# Altium project Mosquito.PrjPcb
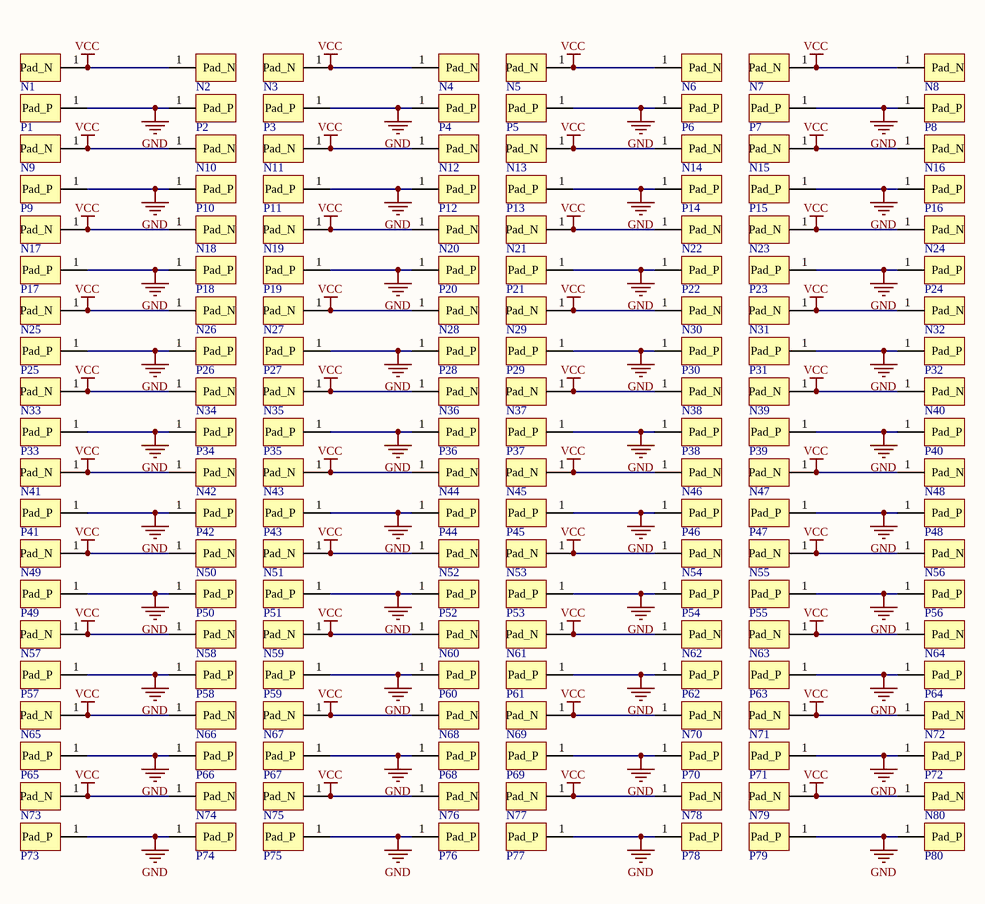
[diagram p0: Mosquito.SchDoc]
3 sheets, 400 parts. Net scope: global (net labels, ports and power ports of the same name join across sheets).
Board file: Mosquito.PcbDoc
Sheets:
  Mosquito.SchDoc
  Mosquito2.SchDoc
  Mosquito3.SchDoc

## Sheet Mosquito.SchDoc
size A4

### Parts
N1  Pad_N  [Pad]  (value not drawn)
N2  Pad_N  [Pad]  (value not drawn)
N3  Pad_N  [Pad]  (value not drawn)
N4  Pad_N  [Pad]  (value not drawn)
N5  Pad_N  [Pad]  (value not drawn)
N6  Pad_N  [Pad]  (value not drawn)
N7  Pad_N  [Pad]  (value not drawn)
N8  Pad_N  [Pad]  (value not drawn)
N9  Pad_N  [Pad]  (value not drawn)
N10  Pad_N  [Pad]  (value not drawn)
N11  Pad_N  [Pad]  (value not drawn)
N12  Pad_N  [Pad]  (value not drawn)
N13  Pad_N  [Pad]  (value not drawn)
N14  Pad_N  [Pad]  (value not drawn)
N15  Pad_N  [Pad]  (value not drawn)
N16  Pad_N  [Pad]  (value not drawn)
N17  Pad_N  [Pad]  (value not drawn)
N18  Pad_N  [Pad]  (value not drawn)
N19  Pad_N  [Pad]  (value not drawn)
N20  Pad_N  [Pad]  (value not drawn)
N21  Pad_N  [Pad]  (value not drawn)
N22  Pad_N  [Pad]  (value not drawn)
N23  Pad_N  [Pad]  (value not drawn)
N24  Pad_N  [Pad]  (value not drawn)
N25  Pad_N  [Pad]  (value not drawn)
N26  Pad_N  [Pad]  (value not drawn)
N27  Pad_N  [Pad]  (value not drawn)
N28  Pad_N  [Pad]  (value not drawn)
N29  Pad_N  [Pad]  (value not drawn)
N30  Pad_N  [Pad]  (value not drawn)
N31  Pad_N  [Pad]  (value not drawn)
N32  Pad_N  [Pad]  (value not drawn)
N33  Pad_N  [Pad]  (value not drawn)
N34  Pad_N  [Pad]  (value not drawn)
N35  Pad_N  [Pad]  (value not drawn)
N36  Pad_N  [Pad]  (value not drawn)
N37  Pad_N  [Pad]  (value not drawn)
N38  Pad_N  [Pad]  (value not drawn)
N39  Pad_N  [Pad]  (value not drawn)
N40  Pad_N  [Pad]  (value not drawn)
N41  Pad_N  [Pad]  (value not drawn)
N42  Pad_N  [Pad]  (value not drawn)
N43  Pad_N  [Pad]  (value not drawn)
N44  Pad_N  [Pad]  (value not drawn)
N45  Pad_N  [Pad]  (value not drawn)
N46  Pad_N  [Pad]  (value not drawn)
N47  Pad_N  [Pad]  (value not drawn)
N48  Pad_N  [Pad]  (value not drawn)
N49  Pad_N  [Pad]  (value not drawn)
N50  Pad_N  [Pad]  (value not drawn)
N51  Pad_N  [Pad]  (value not drawn)
N52  Pad_N  [Pad]  (value not drawn)
N53  Pad_N  [Pad]  (value not drawn)
N54  Pad_N  [Pad]  (value not drawn)
N55  Pad_N  [Pad]  (value not drawn)
N56  Pad_N  [Pad]  (value not drawn)
N57  Pad_N  [Pad]  (value not drawn)
N58  Pad_N  [Pad]  (value not drawn)
N59  Pad_N  [Pad]  (value not drawn)
N60  Pad_N  [Pad]  (value not drawn)
N61  Pad_N  [Pad]  (value not drawn)
N62  Pad_N  [Pad]  (value not drawn)
N63  Pad_N  [Pad]  (value not drawn)
N64  Pad_N  [Pad]  (value not drawn)
N65  Pad_N  [Pad]  (value not drawn)
N66  Pad_N  [Pad]  (value not drawn)
N67  Pad_N  [Pad]  (value not drawn)
N68  Pad_N  [Pad]  (value not drawn)
N69  Pad_N  [Pad]  (value not drawn)
N70  Pad_N  [Pad]  (value not drawn)
N71  Pad_N  [Pad]  (value not drawn)
N72  Pad_N  [Pad]  (value not drawn)
N73  Pad_N  [Pad]  (value not drawn)
N74  Pad_N  [Pad]  (value not drawn)
N75  Pad_N  [Pad]  (value not drawn)
N76  Pad_N  [Pad]  (value not drawn)
N77  Pad_N  [Pad]  (value not drawn)
N78  Pad_N  [Pad]  (value not drawn)
N79  Pad_N  [Pad]  (value not drawn)
N80  Pad_N  [Pad]  (value not drawn)
P1  Pad_P  [Pad]  (value not drawn)
P2  Pad_P  [Pad]  (value not drawn)
P3  Pad_P  [Pad]  (value not drawn)
P4  Pad_P  [Pad]  (value not drawn)
P5  Pad_P  [Pad]  (value not drawn)
P6  Pad_P  [Pad]  (value not drawn)
P7  Pad_P  [Pad]  (value not drawn)
P8  Pad_P  [Pad]  (value not drawn)
P9  Pad_P  [Pad]  (value not drawn)
P10  Pad_P  [Pad]  (value not drawn)
P11  Pad_P  [Pad]  (value not drawn)
P12  Pad_P  [Pad]  (value not drawn)
P13  Pad_P  [Pad]  (value not drawn)
P14  Pad_P  [Pad]  (value not drawn)
P15  Pad_P  [Pad]  (value not drawn)
P16  Pad_P  [Pad]  (value not drawn)
P17  Pad_P  [Pad]  (value not drawn)
P18  Pad_P  [Pad]  (value not drawn)
P19  Pad_P  [Pad]  (value not drawn)
P20  Pad_P  [Pad]  (value not drawn)
P21  Pad_P  [Pad]  (value not drawn)
P22  Pad_P  [Pad]  (value not drawn)
P23  Pad_P  [Pad]  (value not drawn)
P24  Pad_P  [Pad]  (value not drawn)
P25  Pad_P  [Pad]  (value not drawn)
P26  Pad_P  [Pad]  (value not drawn)
P27  Pad_P  [Pad]  (value not drawn)
P28  Pad_P  [Pad]  (value not drawn)
P29  Pad_P  [Pad]  (value not drawn)
P30  Pad_P  [Pad]  (value not drawn)
P31  Pad_P  [Pad]  (value not drawn)
P32  Pad_P  [Pad]  (value not drawn)
P33  Pad_P  [Pad]  (value not drawn)
P34  Pad_P  [Pad]  (value not drawn)
P35  Pad_P  [Pad]  (value not drawn)
P36  Pad_P  [Pad]  (value not drawn)
P37  Pad_P  [Pad]  (value not drawn)
P38  Pad_P  [Pad]  (value not drawn)
P39  Pad_P  [Pad]  (value not drawn)
P40  Pad_P  [Pad]  (value not drawn)
P41  Pad_P  [Pad]  (value not drawn)
P42  Pad_P  [Pad]  (value not drawn)
P43  Pad_P  [Pad]  (value not drawn)
P44  Pad_P  [Pad]  (value not drawn)
P45  Pad_P  [Pad]  (value not drawn)
P46  Pad_P  [Pad]  (value not drawn)
P47  Pad_P  [Pad]  (value not drawn)
P48  Pad_P  [Pad]  (value not drawn)
P49  Pad_P  [Pad]  (value not drawn)
P50  Pad_P  [Pad]  (value not drawn)
P51  Pad_P  [Pad]  (value not drawn)
P52  Pad_P  [Pad]  (value not drawn)
P53  Pad_P  [Pad]  (value not drawn)
P54  Pad_P  [Pad]  (value not drawn)
P55  Pad_P  [Pad]  (value not drawn)
P56  Pad_P  [Pad]  (value not drawn)
P57  Pad_P  [Pad]  (value not drawn)
P58  Pad_P  [Pad]  (value not drawn)
P59  Pad_P  [Pad]  (value not drawn)
P60  Pad_P  [Pad]  (value not drawn)
P61  Pad_P  [Pad]  (value not drawn)
P62  Pad_P  [Pad]  (value not drawn)
P63  Pad_P  [Pad]  (value not drawn)
P64  Pad_P  [Pad]  (value not drawn)
P65  Pad_P  [Pad]  (value not drawn)
P66  Pad_P  [Pad]  (value not drawn)
P67  Pad_P  [Pad]  (value not drawn)
P68  Pad_P  [Pad]  (value not drawn)
P69  Pad_P  [Pad]  (value not drawn)
P70  Pad_P  [Pad]  (value not drawn)
P71  Pad_P  [Pad]  (value not drawn)
P72  Pad_P  [Pad]  (value not drawn)
P73  Pad_P  [Pad]  (value not drawn)
P74  Pad_P  [Pad]  (value not drawn)
P75  Pad_P  [Pad]  (value not drawn)
P76  Pad_P  [Pad]  (value not drawn)
P77  Pad_P  [Pad]  (value not drawn)
P78  Pad_P  [Pad]  (value not drawn)
P79  Pad_P  [Pad]  (value not drawn)
P80  Pad_P  [Pad]  (value not drawn)

### Nets
GND: P1.1(Pad_P) P2.1(Pad_P) P3.1(Pad_P) P4.1(Pad_P) P5.1(Pad_P) P6.1(Pad_P) P7.1(Pad_P) P8.1(Pad_P) P9.1(Pad_P) P10.1(Pad_P) P11.1(Pad_P) P12.1(Pad_P) P13.1(Pad_P) P14.1(Pad_P) P15.1(Pad_P) P16.1(Pad_P) P17.1(Pad_P) P18.1(Pad_P) P19.1(Pad_P) P20.1(Pad_P) P21.1(Pad_P) P22.1(Pad_P) P23.1(Pad_P) P24.1(Pad_P) P25.1(Pad_P) P26.1(Pad_P) P27.1(Pad_P) P28.1(Pad_P) P29.1(Pad_P) P30.1(Pad_P) P31.1(Pad_P) P32.1(Pad_P) P33.1(Pad_P) P34.1(Pad_P) P35.1(Pad_P) P36.1(Pad_P) P37.1(Pad_P) P38.1(Pad_P) P39.1(Pad_P) P40.1(Pad_P) P41.1(Pad_P) P42.1(Pad_P) P43.1(Pad_P) P44.1(Pad_P) P45.1(Pad_P) P46.1(Pad_P) P47.1(Pad_P) P48.1(Pad_P) P49.1(Pad_P) P50.1(Pad_P) P51.1(Pad_P) P52.1(Pad_P) P53.1(Pad_P) P54.1(Pad_P) P55.1(Pad_P) P56.1(Pad_P) P57.1(Pad_P) P58.1(Pad_P) P59.1(Pad_P) P60.1(Pad_P) P61.1(Pad_P) P62.1(Pad_P) P63.1(Pad_P) P64.1(Pad_P) P65.1(Pad_P) P66.1(Pad_P) P67.1(Pad_P) P68.1(Pad_P) P69.1(Pad_P) P70.1(Pad_P) P71.1(Pad_P) P72.1(Pad_P) P73.1(Pad_P) P74.1(Pad_P) P75.1(Pad_P) P76.1(Pad_P) P77.1(Pad_P) P78.1(Pad_P) P79.1(Pad_P) P80.1(Pad_P)
VCC: N1.1(Pad_N) N2.1(Pad_N) N3.1(Pad_N) N4.1(Pad_N) N5.1(Pad_N) N6.1(Pad_N) N7.1(Pad_N) N8.1(Pad_N) N9.1(Pad_N) N10.1(Pad_N) N11.1(Pad_N) N12.1(Pad_N) N13.1(Pad_N) N14.1(Pad_N) N15.1(Pad_N) N16.1(Pad_N) N17.1(Pad_N) N18.1(Pad_N) N19.1(Pad_N) N20.1(Pad_N) N21.1(Pad_N) N22.1(Pad_N) N23.1(Pad_N) N24.1(Pad_N) N25.1(Pad_N) N26.1(Pad_N) N27.1(Pad_N) N28.1(Pad_N) N29.1(Pad_N) N30.1(Pad_N) N31.1(Pad_N) N32.1(Pad_N) N33.1(Pad_N) N34.1(Pad_N) N35.1(Pad_N) N36.1(Pad_N) N37.1(Pad_N) N38.1(Pad_N) N39.1(Pad_N) N40.1(Pad_N) N41.1(Pad_N) N42.1(Pad_N) N43.1(Pad_N) N44.1(Pad_N) N45.1(Pad_N) N46.1(Pad_N) N47.1(Pad_N) N48.1(Pad_N) N49.1(Pad_N) N50.1(Pad_N) N51.1(Pad_N) N52.1(Pad_N) N53.1(Pad_N) N54.1(Pad_N) N55.1(Pad_N) N56.1(Pad_N) N57.1(Pad_N) N58.1(Pad_N) N59.1(Pad_N) N60.1(Pad_N) N61.1(Pad_N) N62.1(Pad_N) N63.1(Pad_N) N64.1(Pad_N) N65.1(Pad_N) N66.1(Pad_N) N67.1(Pad_N) N68.1(Pad_N) N69.1(Pad_N) N70.1(Pad_N) N71.1(Pad_N) N72.1(Pad_N) N73.1(Pad_N) N74.1(Pad_N) N75.1(Pad_N) N76.1(Pad_N) N77.1(Pad_N) N78.1(Pad_N) N79.1(Pad_N) N80.1(Pad_N)

## Sheet Mosquito2.SchDoc
size A4
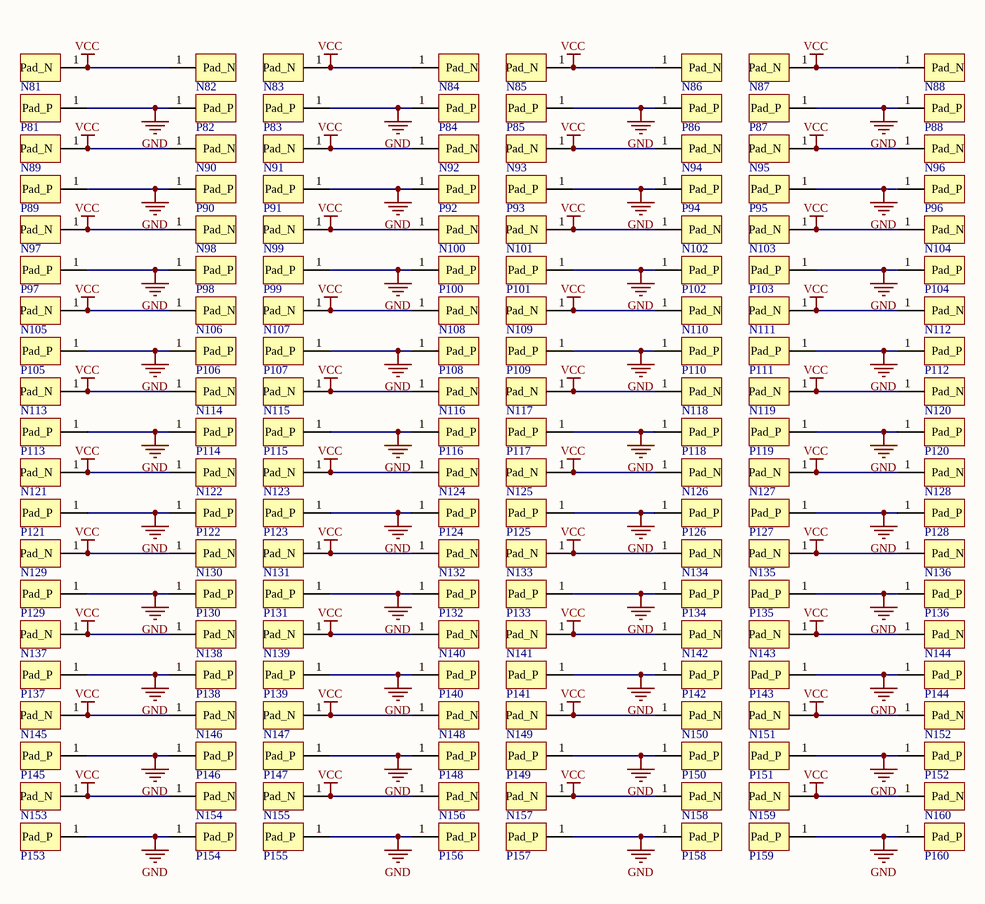
[diagram p1: Mosquito2.SchDoc]

### Parts
N81  Pad_N  [Pad]  (value not drawn)
N82  Pad_N  [Pad]  (value not drawn)
N83  Pad_N  [Pad]  (value not drawn)
N84  Pad_N  [Pad]  (value not drawn)
N85  Pad_N  [Pad]  (value not drawn)
N86  Pad_N  [Pad]  (value not drawn)
N87  Pad_N  [Pad]  (value not drawn)
N88  Pad_N  [Pad]  (value not drawn)
N89  Pad_N  [Pad]  (value not drawn)
N90  Pad_N  [Pad]  (value not drawn)
N91  Pad_N  [Pad]  (value not drawn)
N92  Pad_N  [Pad]  (value not drawn)
N93  Pad_N  [Pad]  (value not drawn)
N94  Pad_N  [Pad]  (value not drawn)
N95  Pad_N  [Pad]  (value not drawn)
N96  Pad_N  [Pad]  (value not drawn)
N97  Pad_N  [Pad]  (value not drawn)
N98  Pad_N  [Pad]  (value not drawn)
N99  Pad_N  [Pad]  (value not drawn)
N100  Pad_N  [Pad]  (value not drawn)
N101  Pad_N  [Pad]  (value not drawn)
N102  Pad_N  [Pad]  (value not drawn)
N103  Pad_N  [Pad]  (value not drawn)
N104  Pad_N  [Pad]  (value not drawn)
N105  Pad_N  [Pad]  (value not drawn)
N106  Pad_N  [Pad]  (value not drawn)
N107  Pad_N  [Pad]  (value not drawn)
N108  Pad_N  [Pad]  (value not drawn)
N109  Pad_N  [Pad]  (value not drawn)
N110  Pad_N  [Pad]  (value not drawn)
N111  Pad_N  [Pad]  (value not drawn)
N112  Pad_N  [Pad]  (value not drawn)
N113  Pad_N  [Pad]  (value not drawn)
N114  Pad_N  [Pad]  (value not drawn)
N115  Pad_N  [Pad]  (value not drawn)
N116  Pad_N  [Pad]  (value not drawn)
N117  Pad_N  [Pad]  (value not drawn)
N118  Pad_N  [Pad]  (value not drawn)
N119  Pad_N  [Pad]  (value not drawn)
N120  Pad_N  [Pad]  (value not drawn)
N121  Pad_N  [Pad]  (value not drawn)
N122  Pad_N  [Pad]  (value not drawn)
N123  Pad_N  [Pad]  (value not drawn)
N124  Pad_N  [Pad]  (value not drawn)
N125  Pad_N  [Pad]  (value not drawn)
N126  Pad_N  [Pad]  (value not drawn)
N127  Pad_N  [Pad]  (value not drawn)
N128  Pad_N  [Pad]  (value not drawn)
N129  Pad_N  [Pad]  (value not drawn)
N130  Pad_N  [Pad]  (value not drawn)
N131  Pad_N  [Pad]  (value not drawn)
N132  Pad_N  [Pad]  (value not drawn)
N133  Pad_N  [Pad]  (value not drawn)
N134  Pad_N  [Pad]  (value not drawn)
N135  Pad_N  [Pad]  (value not drawn)
N136  Pad_N  [Pad]  (value not drawn)
N137  Pad_N  [Pad]  (value not drawn)
N138  Pad_N  [Pad]  (value not drawn)
N139  Pad_N  [Pad]  (value not drawn)
N140  Pad_N  [Pad]  (value not drawn)
N141  Pad_N  [Pad]  (value not drawn)
N142  Pad_N  [Pad]  (value not drawn)
N143  Pad_N  [Pad]  (value not drawn)
N144  Pad_N  [Pad]  (value not drawn)
N145  Pad_N  [Pad]  (value not drawn)
N146  Pad_N  [Pad]  (value not drawn)
N147  Pad_N  [Pad]  (value not drawn)
N148  Pad_N  [Pad]  (value not drawn)
N149  Pad_N  [Pad]  (value not drawn)
N150  Pad_N  [Pad]  (value not drawn)
N151  Pad_N  [Pad]  (value not drawn)
N152  Pad_N  [Pad]  (value not drawn)
N153  Pad_N  [Pad]  (value not drawn)
N154  Pad_N  [Pad]  (value not drawn)
N155  Pad_N  [Pad]  (value not drawn)
N156  Pad_N  [Pad]  (value not drawn)
N157  Pad_N  [Pad]  (value not drawn)
N158  Pad_N  [Pad]  (value not drawn)
N159  Pad_N  [Pad]  (value not drawn)
N160  Pad_N  [Pad]  (value not drawn)
P81  Pad_P  [Pad]  (value not drawn)
P82  Pad_P  [Pad]  (value not drawn)
P83  Pad_P  [Pad]  (value not drawn)
P84  Pad_P  [Pad]  (value not drawn)
P85  Pad_P  [Pad]  (value not drawn)
P86  Pad_P  [Pad]  (value not drawn)
P87  Pad_P  [Pad]  (value not drawn)
P88  Pad_P  [Pad]  (value not drawn)
P89  Pad_P  [Pad]  (value not drawn)
P90  Pad_P  [Pad]  (value not drawn)
P91  Pad_P  [Pad]  (value not drawn)
P92  Pad_P  [Pad]  (value not drawn)
P93  Pad_P  [Pad]  (value not drawn)
P94  Pad_P  [Pad]  (value not drawn)
P95  Pad_P  [Pad]  (value not drawn)
P96  Pad_P  [Pad]  (value not drawn)
P97  Pad_P  [Pad]  (value not drawn)
P98  Pad_P  [Pad]  (value not drawn)
P99  Pad_P  [Pad]  (value not drawn)
P100  Pad_P  [Pad]  (value not drawn)
P101  Pad_P  [Pad]  (value not drawn)
P102  Pad_P  [Pad]  (value not drawn)
P103  Pad_P  [Pad]  (value not drawn)
P104  Pad_P  [Pad]  (value not drawn)
P105  Pad_P  [Pad]  (value not drawn)
P106  Pad_P  [Pad]  (value not drawn)
P107  Pad_P  [Pad]  (value not drawn)
P108  Pad_P  [Pad]  (value not drawn)
P109  Pad_P  [Pad]  (value not drawn)
P110  Pad_P  [Pad]  (value not drawn)
P111  Pad_P  [Pad]  (value not drawn)
P112  Pad_P  [Pad]  (value not drawn)
P113  Pad_P  [Pad]  (value not drawn)
P114  Pad_P  [Pad]  (value not drawn)
P115  Pad_P  [Pad]  (value not drawn)
P116  Pad_P  [Pad]  (value not drawn)
P117  Pad_P  [Pad]  (value not drawn)
P118  Pad_P  [Pad]  (value not drawn)
P119  Pad_P  [Pad]  (value not drawn)
P120  Pad_P  [Pad]  (value not drawn)
P121  Pad_P  [Pad]  (value not drawn)
P122  Pad_P  [Pad]  (value not drawn)
P123  Pad_P  [Pad]  (value not drawn)
P124  Pad_P  [Pad]  (value not drawn)
P125  Pad_P  [Pad]  (value not drawn)
P126  Pad_P  [Pad]  (value not drawn)
P127  Pad_P  [Pad]  (value not drawn)
P128  Pad_P  [Pad]  (value not drawn)
P129  Pad_P  [Pad]  (value not drawn)
P130  Pad_P  [Pad]  (value not drawn)
P131  Pad_P  [Pad]  (value not drawn)
P132  Pad_P  [Pad]  (value not drawn)
P133  Pad_P  [Pad]  (value not drawn)
P134  Pad_P  [Pad]  (value not drawn)
P135  Pad_P  [Pad]  (value not drawn)
P136  Pad_P  [Pad]  (value not drawn)
P137  Pad_P  [Pad]  (value not drawn)
P138  Pad_P  [Pad]  (value not drawn)
P139  Pad_P  [Pad]  (value not drawn)
P140  Pad_P  [Pad]  (value not drawn)
P141  Pad_P  [Pad]  (value not drawn)
P142  Pad_P  [Pad]  (value not drawn)
P143  Pad_P  [Pad]  (value not drawn)
P144  Pad_P  [Pad]  (value not drawn)
P145  Pad_P  [Pad]  (value not drawn)
P146  Pad_P  [Pad]  (value not drawn)
P147  Pad_P  [Pad]  (value not drawn)
P148  Pad_P  [Pad]  (value not drawn)
P149  Pad_P  [Pad]  (value not drawn)
P150  Pad_P  [Pad]  (value not drawn)
P151  Pad_P  [Pad]  (value not drawn)
P152  Pad_P  [Pad]  (value not drawn)
P153  Pad_P  [Pad]  (value not drawn)
P154  Pad_P  [Pad]  (value not drawn)
P155  Pad_P  [Pad]  (value not drawn)
P156  Pad_P  [Pad]  (value not drawn)
P157  Pad_P  [Pad]  (value not drawn)
P158  Pad_P  [Pad]  (value not drawn)
P159  Pad_P  [Pad]  (value not drawn)
P160  Pad_P  [Pad]  (value not drawn)

### Nets
GND: P81.1(Pad_P) P82.1(Pad_P) P83.1(Pad_P) P84.1(Pad_P) P85.1(Pad_P) P86.1(Pad_P) P87.1(Pad_P) P88.1(Pad_P) P89.1(Pad_P) P90.1(Pad_P) P91.1(Pad_P) P92.1(Pad_P) P93.1(Pad_P) P94.1(Pad_P) P95.1(Pad_P) P96.1(Pad_P) P97.1(Pad_P) P98.1(Pad_P) P99.1(Pad_P) P100.1(Pad_P) P101.1(Pad_P) P102.1(Pad_P) P103.1(Pad_P) P104.1(Pad_P) P105.1(Pad_P) P106.1(Pad_P) P107.1(Pad_P) P108.1(Pad_P) P109.1(Pad_P) P110.1(Pad_P) P111.1(Pad_P) P112.1(Pad_P) P113.1(Pad_P) P114.1(Pad_P) P115.1(Pad_P) P116.1(Pad_P) P117.1(Pad_P) P118.1(Pad_P) P119.1(Pad_P) P120.1(Pad_P) P121.1(Pad_P) P122.1(Pad_P) P123.1(Pad_P) P124.1(Pad_P) P125.1(Pad_P) P126.1(Pad_P) P127.1(Pad_P) P128.1(Pad_P) P129.1(Pad_P) P130.1(Pad_P) P131.1(Pad_P) P132.1(Pad_P) P133.1(Pad_P) P134.1(Pad_P) P135.1(Pad_P) P136.1(Pad_P) P137.1(Pad_P) P138.1(Pad_P) P139.1(Pad_P) P140.1(Pad_P) P141.1(Pad_P) P142.1(Pad_P) P143.1(Pad_P) P144.1(Pad_P) P145.1(Pad_P) P146.1(Pad_P) P147.1(Pad_P) P148.1(Pad_P) P149.1(Pad_P) P150.1(Pad_P) P151.1(Pad_P) P152.1(Pad_P) P153.1(Pad_P) P154.1(Pad_P) P155.1(Pad_P) P156.1(Pad_P) P157.1(Pad_P) P158.1(Pad_P) P159.1(Pad_P) P160.1(Pad_P)
VCC: N81.1(Pad_N) N82.1(Pad_N) N83.1(Pad_N) N84.1(Pad_N) N85.1(Pad_N) N86.1(Pad_N) N87.1(Pad_N) N88.1(Pad_N) N89.1(Pad_N) N90.1(Pad_N) N91.1(Pad_N) N92.1(Pad_N) N93.1(Pad_N) N94.1(Pad_N) N95.1(Pad_N) N96.1(Pad_N) N97.1(Pad_N) N98.1(Pad_N) N99.1(Pad_N) N100.1(Pad_N) N101.1(Pad_N) N102.1(Pad_N) N103.1(Pad_N) N104.1(Pad_N) N105.1(Pad_N) N106.1(Pad_N) N107.1(Pad_N) N108.1(Pad_N) N109.1(Pad_N) N110.1(Pad_N) N111.1(Pad_N) N112.1(Pad_N) N113.1(Pad_N) N114.1(Pad_N) N115.1(Pad_N) N116.1(Pad_N) N117.1(Pad_N) N118.1(Pad_N) N119.1(Pad_N) N120.1(Pad_N) N121.1(Pad_N) N122.1(Pad_N) N123.1(Pad_N) N124.1(Pad_N) N125.1(Pad_N) N126.1(Pad_N) N127.1(Pad_N) N128.1(Pad_N) N129.1(Pad_N) N130.1(Pad_N) N131.1(Pad_N) N132.1(Pad_N) N133.1(Pad_N) N134.1(Pad_N) N135.1(Pad_N) N136.1(Pad_N) N137.1(Pad_N) N138.1(Pad_N) N139.1(Pad_N) N140.1(Pad_N) N141.1(Pad_N) N142.1(Pad_N) N143.1(Pad_N) N144.1(Pad_N) N145.1(Pad_N) N146.1(Pad_N) N147.1(Pad_N) N148.1(Pad_N) N149.1(Pad_N) N150.1(Pad_N) N151.1(Pad_N) N152.1(Pad_N) N153.1(Pad_N) N154.1(Pad_N) N155.1(Pad_N) N156.1(Pad_N) N157.1(Pad_N) N158.1(Pad_N) N159.1(Pad_N) N160.1(Pad_N)

## Sheet Mosquito3.SchDoc
size A4
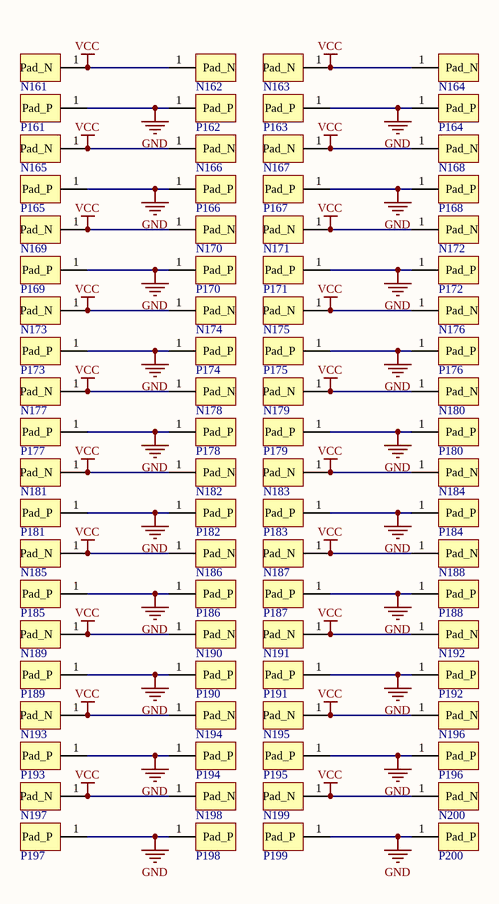
[diagram p2: Mosquito3.SchDoc]

### Parts
N161  Pad_N  [Pad]  (value not drawn)
N162  Pad_N  [Pad]  (value not drawn)
N163  Pad_N  [Pad]  (value not drawn)
N164  Pad_N  [Pad]  (value not drawn)
N165  Pad_N  [Pad]  (value not drawn)
N166  Pad_N  [Pad]  (value not drawn)
N167  Pad_N  [Pad]  (value not drawn)
N168  Pad_N  [Pad]  (value not drawn)
N169  Pad_N  [Pad]  (value not drawn)
N170  Pad_N  [Pad]  (value not drawn)
N171  Pad_N  [Pad]  (value not drawn)
N172  Pad_N  [Pad]  (value not drawn)
N173  Pad_N  [Pad]  (value not drawn)
N174  Pad_N  [Pad]  (value not drawn)
N175  Pad_N  [Pad]  (value not drawn)
N176  Pad_N  [Pad]  (value not drawn)
N177  Pad_N  [Pad]  (value not drawn)
N178  Pad_N  [Pad]  (value not drawn)
N179  Pad_N  [Pad]  (value not drawn)
N180  Pad_N  [Pad]  (value not drawn)
N181  Pad_N  [Pad]  (value not drawn)
N182  Pad_N  [Pad]  (value not drawn)
N183  Pad_N  [Pad]  (value not drawn)
N184  Pad_N  [Pad]  (value not drawn)
N185  Pad_N  [Pad]  (value not drawn)
N186  Pad_N  [Pad]  (value not drawn)
N187  Pad_N  [Pad]  (value not drawn)
N188  Pad_N  [Pad]  (value not drawn)
N189  Pad_N  [Pad]  (value not drawn)
N190  Pad_N  [Pad]  (value not drawn)
N191  Pad_N  [Pad]  (value not drawn)
N192  Pad_N  [Pad]  (value not drawn)
N193  Pad_N  [Pad]  (value not drawn)
N194  Pad_N  [Pad]  (value not drawn)
N195  Pad_N  [Pad]  (value not drawn)
N196  Pad_N  [Pad]  (value not drawn)
N197  Pad_N  [Pad]  (value not drawn)
N198  Pad_N  [Pad]  (value not drawn)
N199  Pad_N  [Pad]  (value not drawn)
N200  Pad_N  [Pad]  (value not drawn)
P161  Pad_P  [Pad]  (value not drawn)
P162  Pad_P  [Pad]  (value not drawn)
P163  Pad_P  [Pad]  (value not drawn)
P164  Pad_P  [Pad]  (value not drawn)
P165  Pad_P  [Pad]  (value not drawn)
P166  Pad_P  [Pad]  (value not drawn)
P167  Pad_P  [Pad]  (value not drawn)
P168  Pad_P  [Pad]  (value not drawn)
P169  Pad_P  [Pad]  (value not drawn)
P170  Pad_P  [Pad]  (value not drawn)
P171  Pad_P  [Pad]  (value not drawn)
P172  Pad_P  [Pad]  (value not drawn)
P173  Pad_P  [Pad]  (value not drawn)
P174  Pad_P  [Pad]  (value not drawn)
P175  Pad_P  [Pad]  (value not drawn)
P176  Pad_P  [Pad]  (value not drawn)
P177  Pad_P  [Pad]  (value not drawn)
P178  Pad_P  [Pad]  (value not drawn)
P179  Pad_P  [Pad]  (value not drawn)
P180  Pad_P  [Pad]  (value not drawn)
P181  Pad_P  [Pad]  (value not drawn)
P182  Pad_P  [Pad]  (value not drawn)
P183  Pad_P  [Pad]  (value not drawn)
P184  Pad_P  [Pad]  (value not drawn)
P185  Pad_P  [Pad]  (value not drawn)
P186  Pad_P  [Pad]  (value not drawn)
P187  Pad_P  [Pad]  (value not drawn)
P188  Pad_P  [Pad]  (value not drawn)
P189  Pad_P  [Pad]  (value not drawn)
P190  Pad_P  [Pad]  (value not drawn)
P191  Pad_P  [Pad]  (value not drawn)
P192  Pad_P  [Pad]  (value not drawn)
P193  Pad_P  [Pad]  (value not drawn)
P194  Pad_P  [Pad]  (value not drawn)
P195  Pad_P  [Pad]  (value not drawn)
P196  Pad_P  [Pad]  (value not drawn)
P197  Pad_P  [Pad]  (value not drawn)
P198  Pad_P  [Pad]  (value not drawn)
P199  Pad_P  [Pad]  (value not drawn)
P200  Pad_P  [Pad]  (value not drawn)

### Nets
GND: P161.1(Pad_P) P162.1(Pad_P) P163.1(Pad_P) P164.1(Pad_P) P165.1(Pad_P) P166.1(Pad_P) P167.1(Pad_P) P168.1(Pad_P) P169.1(Pad_P) P170.1(Pad_P) P171.1(Pad_P) P172.1(Pad_P) P173.1(Pad_P) P174.1(Pad_P) P175.1(Pad_P) P176.1(Pad_P) P177.1(Pad_P) P178.1(Pad_P) P179.1(Pad_P) P180.1(Pad_P) P181.1(Pad_P) P182.1(Pad_P) P183.1(Pad_P) P184.1(Pad_P) P185.1(Pad_P) P186.1(Pad_P) P187.1(Pad_P) P188.1(Pad_P) P189.1(Pad_P) P190.1(Pad_P) P191.1(Pad_P) P192.1(Pad_P) P193.1(Pad_P) P194.1(Pad_P) P195.1(Pad_P) P196.1(Pad_P) P197.1(Pad_P) P198.1(Pad_P) P199.1(Pad_P) P200.1(Pad_P)
VCC: N161.1(Pad_N) N162.1(Pad_N) N163.1(Pad_N) N164.1(Pad_N) N165.1(Pad_N) N166.1(Pad_N) N167.1(Pad_N) N168.1(Pad_N) N169.1(Pad_N) N170.1(Pad_N) N171.1(Pad_N) N172.1(Pad_N) N173.1(Pad_N) N174.1(Pad_N) N175.1(Pad_N) N176.1(Pad_N) N177.1(Pad_N) N178.1(Pad_N) N179.1(Pad_N) N180.1(Pad_N) N181.1(Pad_N) N182.1(Pad_N) N183.1(Pad_N) N184.1(Pad_N) N185.1(Pad_N) N186.1(Pad_N) N187.1(Pad_N) N188.1(Pad_N) N189.1(Pad_N) N190.1(Pad_N) N191.1(Pad_N) N192.1(Pad_N) N193.1(Pad_N) N194.1(Pad_N) N195.1(Pad_N) N196.1(Pad_N) N197.1(Pad_N) N198.1(Pad_N) N199.1(Pad_N) N200.1(Pad_N)

## Nets that join several sheets
GND: Mosquito (80 pins), Mosquito2 (80 pins), Mosquito3 (40 pins)
VCC: Mosquito (80 pins), Mosquito2 (80 pins), Mosquito3 (40 pins)